# EAGLE design T-connect (EAGLE 6.5.0)
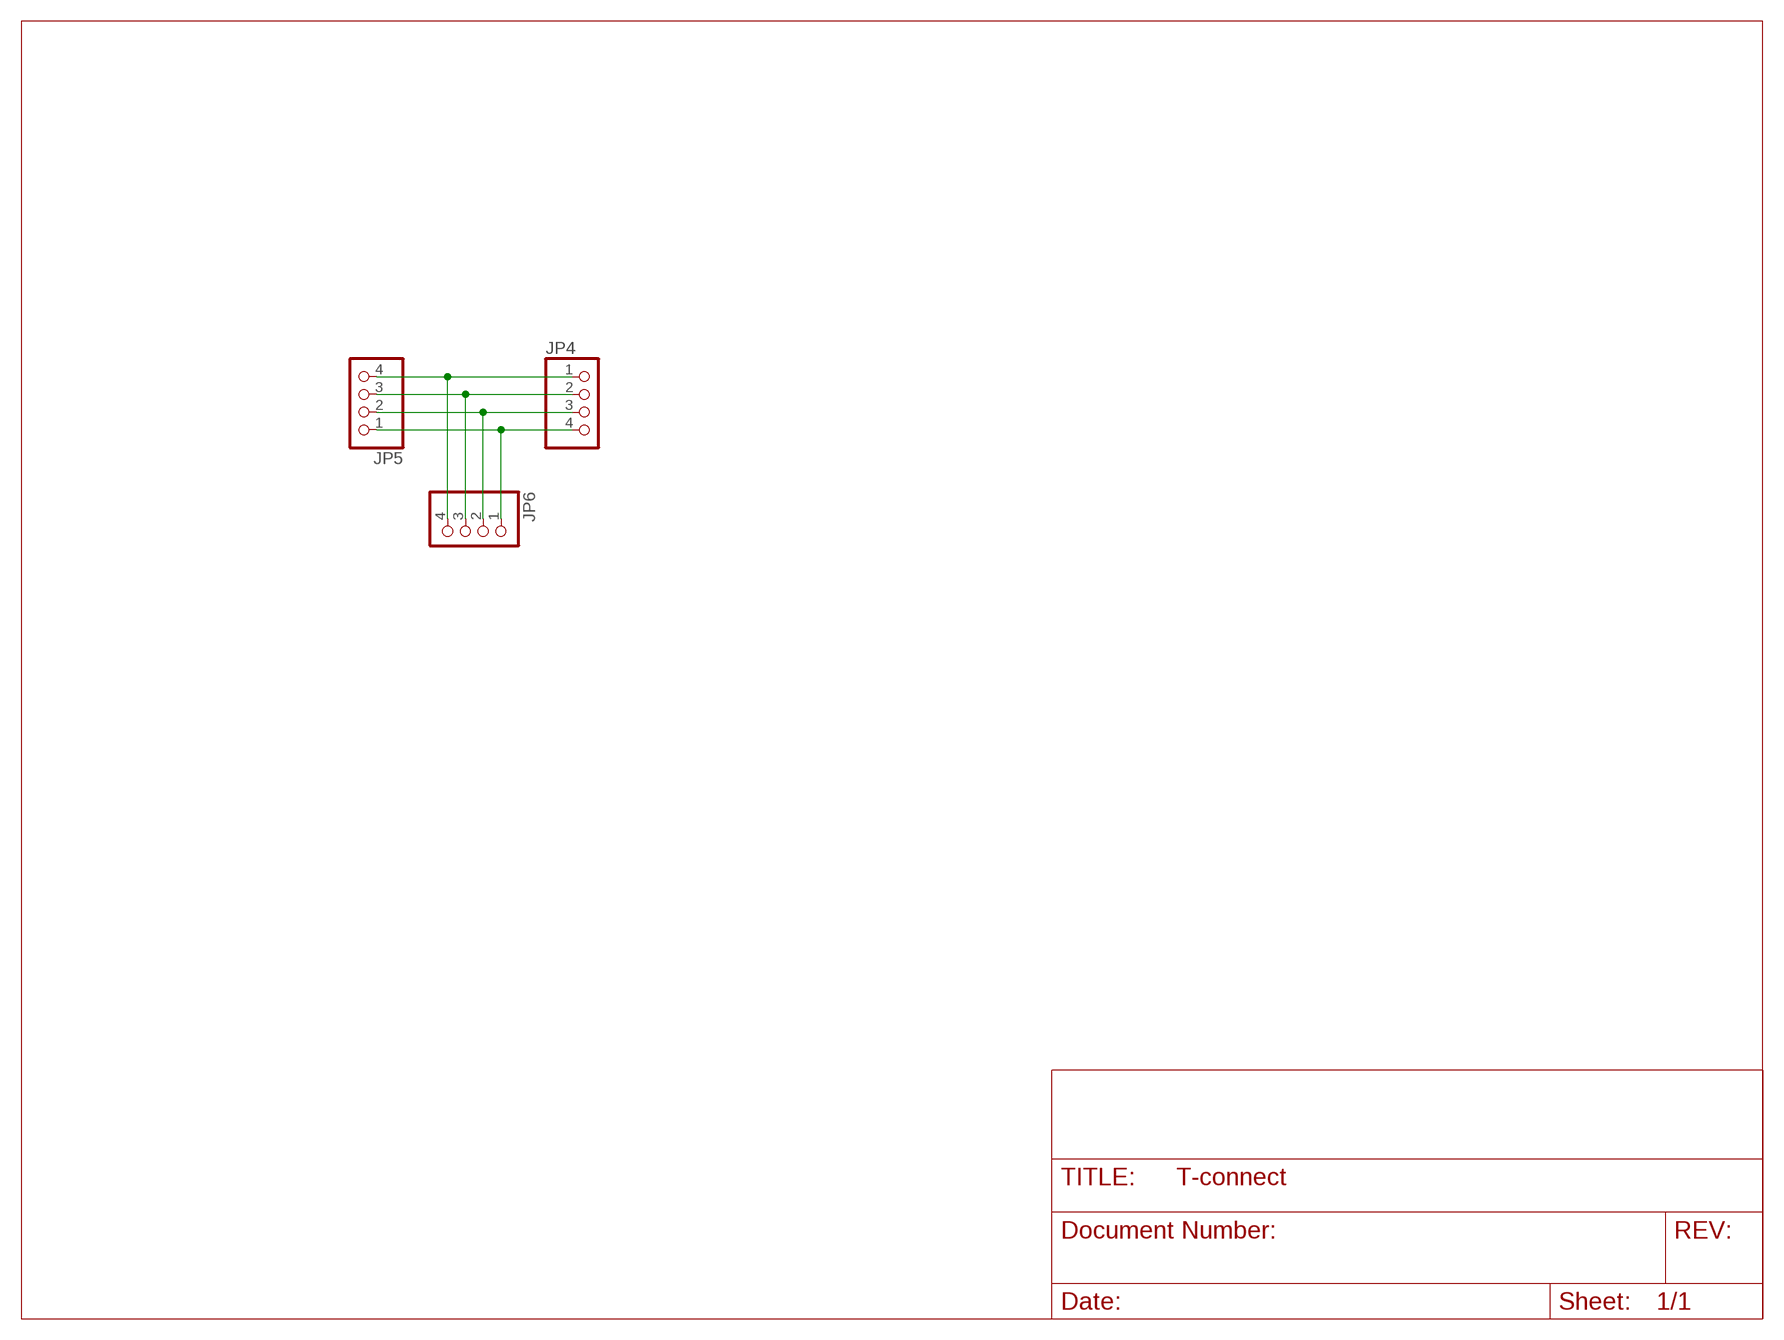
[diagram p0: schematic, sheet 1]

## Parts
JP4  PINHD-1X4/90  [1X04/90]
JP5  PINHD-1X4/90  [1X04/90]
JP6  PINHD-1X4/90  [1X04/90]

## Nets
N$1: JP4.1 JP5.4 JP6.4
N$2: JP4.2 JP5.3 JP6.3
N$3: JP4.3 JP5.2 JP6.2
N$4: JP4.4 JP5.1 JP6.1

## Library data of the parts
JP4-JP6 = pinhead:PINHD-1X4: PIN HEADER

## Board
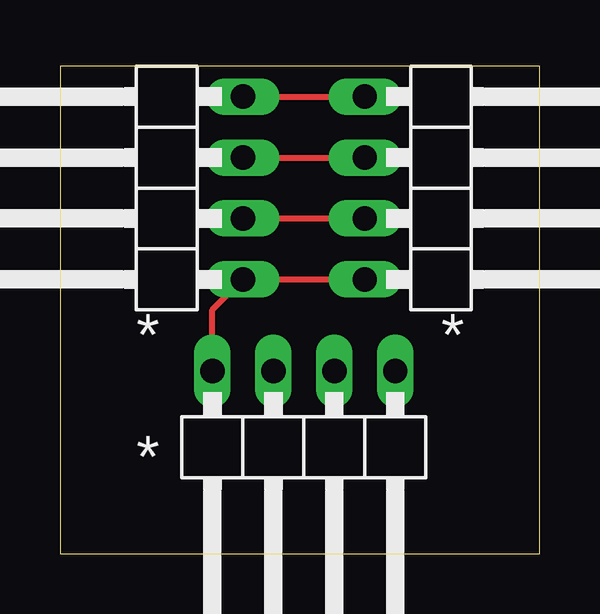
[diagram p1: board, top side]
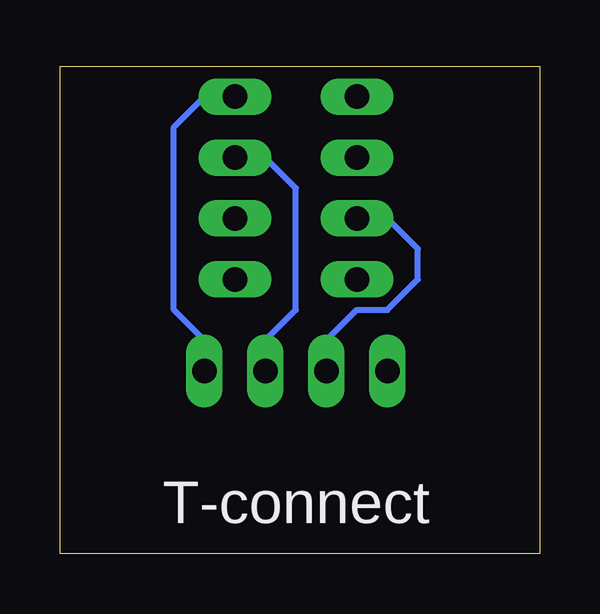
[diagram p2: board, bottom side, seen from below]

Size 19.99 x 20.31 mm. Coordinates in mm from the lower left corner, seen from the top.
Outline: 0,0 19.99,0 19.99,20.31 0,20.31 0,0
Copper layers (1*16): Top 0.0356mm / dielectric 1.5011mm / Bottom 0.0356mm
Design rules "LaenPCBOrder": minimum track width 6mil, minimum drill 13mil, track to track 6mil, track to pad 6mil, pad to pad 6mil, via to via 6mil, smd to smd 6mil, copper to edge 15mil, drill to drill 6mil, minimum pad ring 7mil, minimum via ring 7mil, stop-mask expansion 3mil, vias tented up to drill 0mil, thermal gap 10mil

### Footprints (pad centres in the part's own frame; a part is rotated, then mirrored left to right if it is on the bottom)
1X04/90 = drill 1.016 long: 1 -3.81,-3.81; 2 -1.27,-3.81; 3 1.27,-3.81; 4 3.81,-3.81

### Placement (x,y rotation side)
JP4  3.81,15.24 90 top
JP5  16.51,15.24 270 top
JP6  10.16,3.81 180 top

### Tracks (layer width: path | path; a pad name or v marks a point on that pad's centre or on a via)
N$1
  Top 0.254: JP5.4 JP4.1 6.35,10.16 JP6.4
N$2
  Top 0.254: JP4.2 JP5.3
  Bottom 0.254: JP6.3 8.89,8.89 7.62,10.16 6.35,10.16 5.08,11.43 5.08,12.7 6.35,13.97 JP4.2
N$3
  Top 0.254: JP4.3 JP5.2
  Bottom 0.254: JP6.2 11.43,8.89 10.16,10.16 10.16,15.24 11.43,16.51 JP5.2
N$4
  Top 0.254: JP4.4 JP5.1
  Bottom 0.254: JP6.1 13.97,8.89 15.24,10.16 15.24,17.78 13.97,19.05 JP5.1

### Text on the board
tNames: * | * | *
bNames: T-connect